# EAGLE design project8085 (EAGLE 7.3.0)
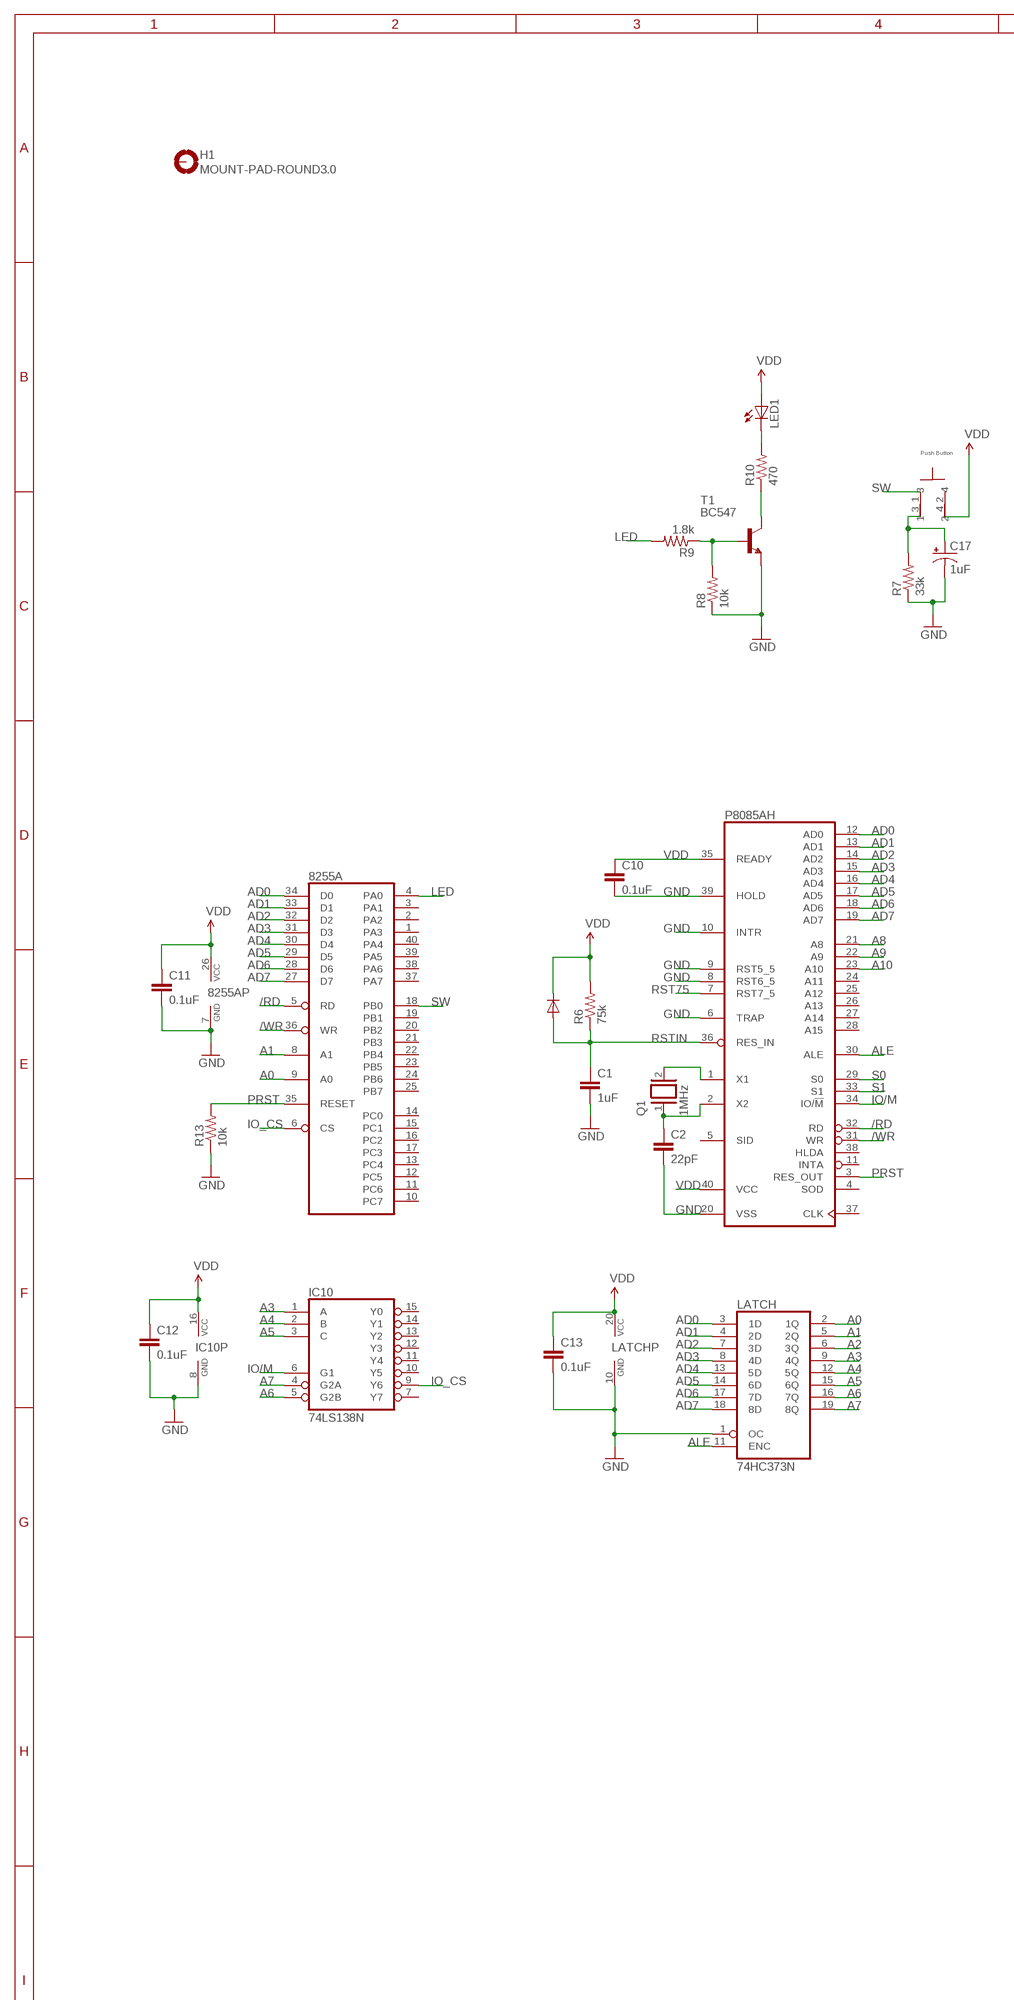
[diagram p0: schematic, sheet 1, part 1 of 2]
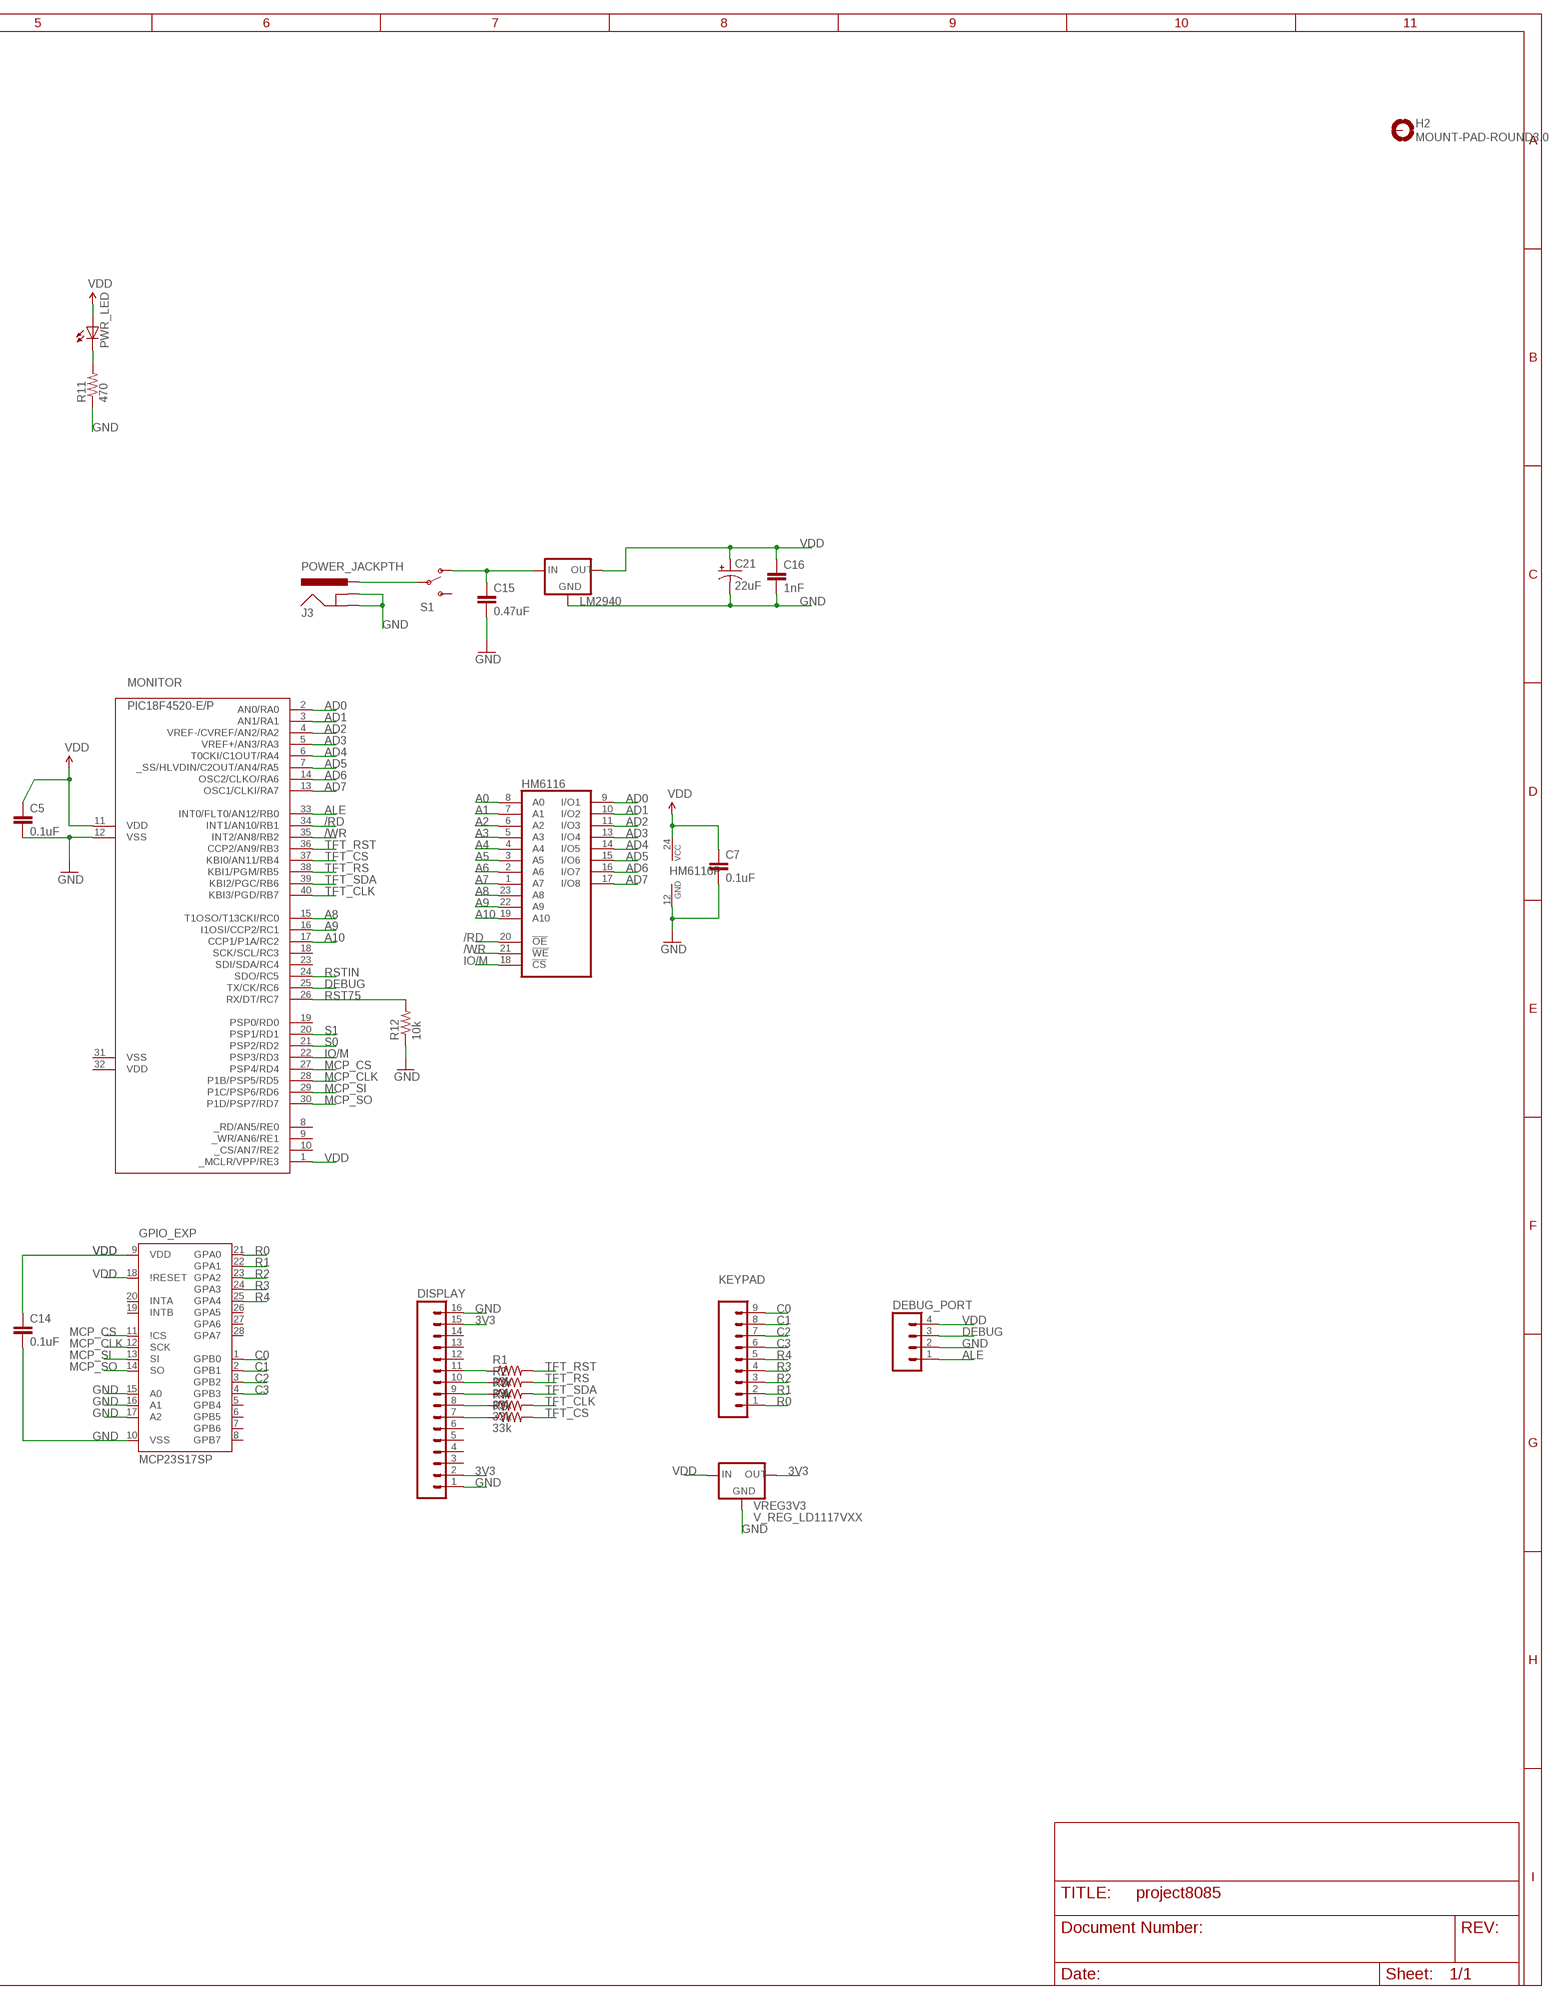
[diagram p1: schematic, sheet 1, part 2 of 2]

## Parts
8255A  8255A  [DIL40]
C1  1uF  CAPPTH  [CAP-PTH-SMALL]
C2  22pF  CAPPTH  [CAP-PTH-SMALL]
C5  0.1uF  CAPPTH  [CAP-PTH-SMALL]
C7  0.1uF  CAPPTH  [CAP-PTH-SMALL]
C10  0.1uF  CAPPTH  [CAP-PTH-SMALL]
C11  0.1uF  CAPPTH  [CAP-PTH-SMALL]
C12  0.1uF  CAPPTH  [CAP-PTH-SMALL]
C13  0.1uF  CAPPTH  [CAP-PTH-SMALL]
C14  0.1uF  CAPPTH  [CAP-PTH-SMALL]
C15  0.47uF  CAPPTH  [CAP-PTH-SMALL]
C16  1nF  CAPPTH  [CAP-PTH-SMALL]
C17  1uF  CAP_POLPTH2  [CPOL-RADIAL-10UF-25V]
C21  22uF  CAP_POLPTH2  [CPOL-RADIAL-10UF-25V]
DEBUG_PORT  M04PTH  [1X04]
DISPLAY  M16PTH  [1X16]
GPIO_EXP  MCP23S17SP  [DIL28-3]
H1  MOUNT-PAD-ROUND3.0  [3,0-PAD]
H2  MOUNT-PAD-ROUND3.0  [3,0-PAD]
HM6116  6116P  [DIL24-6]
IC10  74LS138N  [DIL16]
IN4148  1N4148DO35-10  [DO35-10]
J3  POWER_JACKPTH  [POWER_JACK_PTH]
KEYPAD  M09  [1X09]
LATCH  74HC373N  [DIL20]
LED1  LED5MM  [LED5MM]
LM2940  LM2931T-L  [TO220L1]
MONITOR  PIC18F4520-E/P  [DIL40]
P8085AH  8085  [DIL40]
PWR_LED  LED5MM  [LED5MM]
Q1  1MHz  XTAL  [Q]
R1  33k  RESISTORAXIAL-0.3  [AXIAL-0.3]
R2  33k  RESISTORAXIAL-0.3  [AXIAL-0.3]
R3  33k  RESISTORAXIAL-0.3  [AXIAL-0.3]
R4  33k  RESISTORAXIAL-0.3  [AXIAL-0.3]
R5  33k  RESISTORAXIAL-0.3  [AXIAL-0.3]
R6  75k  RESISTORAXIAL-0.3  [AXIAL-0.3]
R7  33k  RESISTORAXIAL-0.3  [AXIAL-0.3]
R8  10k  RESISTORAXIAL-0.3  [AXIAL-0.3]
R9  1.8k  RESISTORAXIAL-0.3  [AXIAL-0.3]
R10  470  RESISTORAXIAL-0.3  [AXIAL-0.3]
R11  470  RESISTORAXIAL-0.3  [AXIAL-0.3]
R12  10k  RESISTORAXIAL-0.3  [AXIAL-0.3]
R13  10k  RESISTORAXIAL-0.3  [AXIAL-0.3]
S1  SWITCH-SPDTPTH  [SWITCH-SPDT]
T1  BC547  [TO92]
U$3  PUSHBTN  [PUSHBTN]
VREG3V3  V_REG_LD1117VXX  [78XXL]

## Nets
3V3 [power]: DISPLAY.2 DISPLAY.15 VREG3V3.GND(OUT)
/RD: 8255A.5(RD) HM6116.20(!OE) MONITOR.34(INT1/AN10/RB1) P8085AH.32(RD)
/WR: 8255A.36(WR) HM6116.21(!WE) MONITOR.35(INT2/AN8/RB2) P8085AH.31(WR)
A0: 8255A.9(A0) HM6116.8(A0) LATCH.2(1Q)
A1: 8255A.8(A1) HM6116.7(A1) LATCH.5(2Q)
A2: HM6116.6(A2) LATCH.6(3Q)
A3: HM6116.5(A3) IC10.1(A) LATCH.9(4Q)
A4: HM6116.4(A4) IC10.2(B) LATCH.12(5Q)
A5: HM6116.3(A5) IC10.3(C) LATCH.15(6Q)
A6: HM6116.2(A6) IC10.5(G2B) LATCH.16(7Q)
A7: HM6116.1(A7) IC10.4(G2A) LATCH.19(8Q)
A8: HM6116.23(A8) MONITOR.15(T1OSO/T13CKI/RC0) P8085AH.21(A8)
A9: HM6116.22(A9) MONITOR.16(I1OSI/CCP2/RC1) P8085AH.22(A9)
A10: HM6116.19(A10) MONITOR.17(CCP1/P1A/RC2) P8085AH.23(A10)
AD0: 8255A.34(D0) HM6116.9(I/O1) LATCH.3(1D) MONITOR.2(AN0/RA0) P8085AH.12(AD0)
AD1: 8255A.33(D1) HM6116.10(I/O2) LATCH.4(2D) MONITOR.3(AN1/RA1) P8085AH.13(AD1)
AD2: 8255A.32(D2) HM6116.11(I/O3) LATCH.7(3D) MONITOR.4(VREF-/CVREF/AN2/RA2) P8085AH.14(AD2)
AD3: 8255A.31(D3) HM6116.13(I/O4) LATCH.8(4D) MONITOR.5(VREF+/AN3/RA3) P8085AH.15(AD3)
AD4: 8255A.30(D4) HM6116.14(I/O5) LATCH.13(5D) MONITOR.6(T0CKI/C1OUT/RA4) P8085AH.16(AD4)
AD5: 8255A.29(D5) HM6116.15(I/O6) LATCH.14(6D) MONITOR.7(_SS/HLVDIN/C2OUT/AN4/RA5) P8085AH.17(AD5)
AD6: 8255A.28(D6) HM6116.16(I/O7) LATCH.17(7D) MONITOR.14(OSC2/CLKO/RA6) P8085AH.18(AD6)
AD7: 8255A.27(D7) HM6116.17(I/O8) LATCH.18(8D) MONITOR.13(OSC1/CLKI/RA7) P8085AH.19(AD7)
ALE: DEBUG_PORT.1 LATCH.11(ENC) MONITOR.33(INT0/FLT0/AN12/RB0) P8085AH.30(ALE)
C0: GPIO_EXP.1(GPB0) KEYPAD.9
C1: GPIO_EXP.2(GPB1) KEYPAD.8
C2: GPIO_EXP.3(GPB2) KEYPAD.7
C3: GPIO_EXP.4(GPB3) KEYPAD.6
DEBUG: DEBUG_PORT.3 MONITOR.25(TX/CK/RC6)
GND [power]: 8255A.7(GND) C1.2 C2.2 C5.2 C7.2 C10.2 C11.2 C12.2 C13.2 C14.2 C15.2 C16.2 C17.2(-) C21.2(-) DEBUG_PORT.2 DISPLAY.1 DISPLAY.16 GPIO_EXP.10(VSS) GPIO_EXP.15(A0) GPIO_EXP.16(A1) GPIO_EXP.17(A2) HM6116.12(GND) IC10.8(GND) J3.GND J3.GNDBREAK LATCH.1(OC) LATCH.10(GND) LM2940.2(GND) MONITOR.12(VSS) P8085AH.6(TRAP) P8085AH.8(RST6_5) P8085AH.9(RST5_5) P8085AH.10(INTR) P8085AH.20(VSS) P8085AH.39(HOLD) R7.P$1 R8.P$1 R11.P$1 R12.P$1 R13.P$1 T1.1(E) VREG3V3.IN(GND)
IO/M: HM6116.18(!CS) IC10.6(G1) MONITOR.22(PSP3/RD3) P8085AH.34(IO/!M)
IO_CS: 8255A.6(CS) IC10.9(Y6)
LED: 8255A.4(PA0) R9.P$2
MCP_CLK: GPIO_EXP.12(SCK) MONITOR.28(P1B/PSP5/RD5)
MCP_CS: GPIO_EXP.11(\!CS) MONITOR.27(PSP4/RD4)
MCP_SI: GPIO_EXP.13(SI) MONITOR.29(P1C/PSP6/RD6)
MCP_SO: GPIO_EXP.14(SO) MONITOR.30(P1D/PSP7/RD7)
N$1: R8.P$2 R9.P$1 T1.2(B)
N$2: C15.1 LM2940.1(IN) S1.1(O)
N$3: C2.1 P8085AH.2(X2) Q1.1
N$4: P8085AH.1(X1) Q1.2
N$5 [power]: J3.PWR S1.2(P)
N$6: DISPLAY.11 R1.P$1
N$7: DISPLAY.10 R2.P$1
N$8: DISPLAY.9 R3.P$1
N$9: DISPLAY.8 R4.P$1
N$10: DISPLAY.7 R5.P$1
N$12: PWR_LED.K(C) R11.P$2
N$13: R10.P$1 T1.3(C)
N$14: LED1.K(C) R10.P$2
PRST: 8255A.35(RESET) P8085AH.3(RES_OUT) R13.P$2
R0: GPIO_EXP.21(GPA0) KEYPAD.1
R1: GPIO_EXP.22(GPA1) KEYPAD.2
R2: GPIO_EXP.23(GPA2) KEYPAD.3
R3: GPIO_EXP.24(GPA3) KEYPAD.4
R4: GPIO_EXP.25(GPA4) KEYPAD.5
RST75: MONITOR.26(RX/DT/RC7) P8085AH.7(RST7_5) R12.P$2
RSTIN: C1.1 IN4148.A MONITOR.24(SDO/RC5) P8085AH.36(RES_IN) R6.P$1
S0: MONITOR.21(PSP2/RD2) P8085AH.29(S0)
S1: MONITOR.20(PSP1/RD1) P8085AH.33(S1)
SW: 8255A.18(PB0) U$3.1
SW0: C17.1(+) R7.P$2 U$3.3
TFT_CLK: MONITOR.40(KBI3/PGD/RB7) R4.P$2
TFT_CS: MONITOR.37(KBI0/AN11/RB4) R5.P$2
TFT_RS: MONITOR.38(KBI1/PGM/RB5) R2.P$2
TFT_RST: MONITOR.36(CCP2/AN9/RB3) R1.P$2
TFT_SDA: MONITOR.39(KBI2/PGC/RB6) R3.P$2
VDD [power]: 8255A.26(VCC) C5.1 C7.1 C10.1 C11.1 C12.1 C13.1 C14.1 C16.1 C21.1(+) DEBUG_PORT.4 GPIO_EXP.9(VDD) GPIO_EXP.18(\!RESET) HM6116.24(VCC) IC10.16(VCC) IN4148.C LATCH.20(VCC) LED1.A LM2940.3(OUT) MONITOR.1(_MCLR/VPP/RE3) MONITOR.11(VDD) P8085AH.35(READY) P8085AH.40(VCC) PWR_LED.A R6.P$2 U$3.4 VREG3V3.OUT(IN)
Unconnected: 8255A.1(PA3) 8255A.2(PA2) 8255A.3(PA1) 8255A.10(PC7) 8255A.11(PC6) 8255A.12(PC5) 8255A.13(PC4) 8255A.14(PC0) 8255A.15(PC1) 8255A.16(PC2) 8255A.17(PC3) 8255A.19(PB1) 8255A.20(PB2) 8255A.21(PB3) 8255A.22(PB4) 8255A.23(PB5) 8255A.24(PB6) 8255A.25(PB7) 8255A.37(PA7) 8255A.38(PA6) 8255A.39(PA5) 8255A.40(PA4) DISPLAY.3 DISPLAY.4 DISPLAY.5 DISPLAY.6 DISPLAY.12 DISPLAY.13 DISPLAY.14 GPIO_EXP.5(GPB4) GPIO_EXP.6(GPB5) GPIO_EXP.7(GPB6) GPIO_EXP.8(GPB7) GPIO_EXP.19(INTB) GPIO_EXP.20(INTA) GPIO_EXP.26(GPA5) GPIO_EXP.27(GPA6) GPIO_EXP.28(GPA7) H1.B3,0(MOUNT) H2.B3,0(MOUNT) IC10.7(Y7) IC10.10(Y5) IC10.11(Y4) IC10.12(Y3) IC10.13(Y2) IC10.14(Y1) IC10.15(Y0) MONITOR.8(_RD/AN5/RE0) MONITOR.9(_WR/AN6/RE1) MONITOR.10(_CS/AN7/RE2) MONITOR.18(SCK/SCL/RC3) MONITOR.19(PSP0/RD0) MONITOR.23(SDI/SDA/RC4) P8085AH.4(SOD) P8085AH.5(SID) P8085AH.11(INTA) P8085AH.24(A11) P8085AH.25(A12) P8085AH.26(A13) P8085AH.27(A14) P8085AH.28(A15) P8085AH.37(CLK) P8085AH.38(HLDA) S1.3(S) U$3.2

## Power pins joined to a net without a drawn wire
VDD: MONITOR.32(VDD)
VSS: MONITOR.31(VSS)

## Library data of the parts
8255A = micro-intel:8255A: MICROCOMPUTER/PERIPHERAL DEVICE; OC_FARNELL: unknown; OC_NEWARK: unknown
C1 C2 C5 C7 C10-C16 = SparkFun:CAP: Capacitor Standard 0603 ceramic capacitor, and 0.1" leaded capacitor.
C17 C21 = SparkFun:CAP_POL: Capacitor Polarized These are standard SMD and PTH capacitors. Normally 10uF, 47uF, and 100uF in electrolytic and tantalum varieties. Always verify the external diameter of the through hole cap, it varies with capacity, voltage, and manufacturer. The EIA devices should be standard.
DEBUG_PORT = SparkFun-Connectors:M04: Header 4 Standard 4-pin 0.1" header. Use with straight break away headers (SKU : PRT-00116), right angle break away headers (PRT-00553), swiss pins (PRT-00743), machine pins (PRT-00117), and female headers (PRT-00115). Molex polarized connector foot print use with SKU : PRT-08231 with associated crimp pins and housings. 1MM SMD Version SKU: PRT-10208; PROD_ID: CONN-09696
DISPLAY = SparkFun-Connectors:M16: 1x16 .1" header
GPIO_EXP = microchip-update-2:MCP23S17: http://ww1.microchip.com/downloads/en/DeviceDoc/21952a.pdf Source: http://ww1.microchip.com/downloads/en/DeviceDoc/21952a.pdf
H1 H2 = holes:MOUNT-PAD-ROUND: MOUNTING PAD, round
HM6116 = memory-idt:6116P: MEMORY; OC_FARNELL: unknown; OC_NEWARK: unknown
IC10 = 74xx-eu:74*138: 3-line to 8-line DECODER/DEMULTIPLEXER
IN4148 = diode:1N4148: DIODE high speed (Philips)
J3 = SparkFun:POWER_JACK: Power Jack This is the standard 5.5mm barrel jack for power. The PTH is the most common, proven, reliable, footprint. All others are experimental. The Slot footprint only works if the mill layer is transmitted to the PCB fab house so be warned. Spark Fun Electronics SKU : PRT-00119. Mating wall wart : TOL-00298 (and others)
KEYPAD = SparkFun-Connectors:M09: Header 9 Standard 9-pin 0.1" header. Use with straight break away headers (SKU : PRT-00116), right angle break away headers (PRT-00553), swiss pins (PRT-00743), machine pins (PRT-00117), and female headers (PRT-00115).
LATCH = 74xx-eu:74*373: Octal D type transparent LATCH, edge triggered
LED1 PWR_LED = led:LED: LED OSRAM: - CHIPLED LG R971, LG N971, LY N971, LG Q971, LY Q971, LO R971, LY R971 LH N974, LH R974 LS Q976, LO Q976, LY Q976 LO Q996 - Hyper CHIPLED LW Q18S LB Q993, LB Q99A, LB R99A - SideLED LS A670, LO A670, LY A670, LG A670, LP A670 LB A673, LV A673, LT A673, LW A673 LH A674 LY A675 LS A676, LA A676, LO A676, LY A676, LW A676 LS A679, LY A679, LG A679 - Hyper Micro SIDELED® LS Y876, LA Y876, LO Y876, LY Y876 LT Y87S - SmartLED LW L88C, LW L88S LB L89C, LB L89S, LG L890 LS L89K, LO L89K, LY L89K LS L896, LA L896, LO L896, LY L896 - TOPLED LS T670, LO T670, LY T670, LG T670, LP T670 LSG T670, LSP T670, LSY T670, LOP T670, LYG T670 LG T671, LOG T671, LSG T671 LB T673, LV T673, LT T673, LW T673 LH T674 LS T676, LA T676, LO T676, LY T676, LB T676, LH T676, LSB T676, LW T676 LB T67C, LV T67C, LT T67C, LS T67K, LO T67K, LY T67K, LW E67C LS E67B, LA E67B, LO E67B, LY E67B, LB E67C, LV E67C, LT E67C LW T67C LS T679, LY T679, LG T679 LS T770, LO T770, LY T770, LG T770, LP T770 LB T773, LV T773, LT T773, LW T773 LH T774 LS E675, LA E675, LY E675, LS T675 LS T776, LA T776, LO T776, LY T776, LB T776 LHGB T686 LT T68C, LB T68C - Hyper Mini TOPLED® LB M676 - Mini TOPLED Santana® LG M470 LS M47K, LO M47K, LY M47K Source: http://www.osram.convergy.de LUXEON: - LUMILED® LXK2-PW12-R00, LXK2-PW12-S00, LXK2-PW14-U00, LXK2-PW14-V00 LXK2-PM12-R00, LXK2-PM12-S00, LXK2-PM14-U00 LXK2-PE12-Q00, LXK2-PE12-R00, LXK2-PE12-S00, LXK2-PE14-T00, LXK2-PE14-U00 LXK2-PB12-K00, LXK2-PB12-L00, LXK2-PB12-M00, LXK2-PB14-N00, LXK2-PB14-P00, LXK2-PB14-Q00 LXK2-PR12-L00, LXK2-PR12-M00, LXK2-PR14-Q00, LXK2-PR14-R00 LXK2-PD12-Q00, LXK2-PD12-R00, LXK2-PD12-S00 LXK2-PH12-R00, LXK2-PH12-S00 LXK2-PL12-P00, LXK2-PL12-Q00, LXK2-PL12-R00 Source: www.luxeon.com KINGBRIGHT: KA-3528ASYC Source: www.kingbright.com
LM2940 = v-reg-3:LM2931: National Semiconductor <http://www.national.com> Low Dropout Fixed Regulator Vin up to 26V, Reverse Batterie/Load Dump/Short Circuit/Overload Protection,
MONITOR = pic18fxx20:PIC18*4520: PIC18*4520 Microchip FLASH Microcontroller with A/D DEVICE FEATURES Feature PIC18*4520 Program Memory (bytes) 32768 Program Memory (instructions) 16384 Interupt Sources 20 I/O Ports Ports A, B, C, D, E Capture/Compare/PWM Modules 1 Enhanced Capture/Compare/PWM Modules 1 Parallel Communications (PSP) Yes 10-bit Analog-to-Digital Module 13 input Channels Package Types 40-pin PDIP 44-pin TQFP 44-pin QFN NOTES: F only after 18, means standard voltage range from 4.2v to 5.5v LF after 18, means extended voltage range from 2.0v to 5.5v -E before / denotes extended temperature range from -40°C to +120°C -I before / denotes industrial temperature range from -40°C to +85°C /PT suffix denotes TQFP package /SO suffix denotes SOIC package /SP suffix denotes Skinny Plastic DIP package /P suffix denotes Plastic DIP package /ML suffix denotes QFN package
P8085AH = micro-intel:8085: MICROCOMPUTER/PERIPHERAL DEVICE; OC_FARNELL: unknown; OC_NEWARK: unknown
Q1 = special:XTAL: CRYSTAL
R1-R13 = SparkFun-Resistors:RESISTOR: Resistor Basic schematic elements and footprints for 0603, 1206, and PTH resistors.
S1 = SparkFun-Electromechanical:SWITCH-SPDT: SPDT Switch Simple slide switch, Spark Fun Electronics SKU : COM-00102 DPDT SMT slide switch, AYZ0202, SWCH-08179; PROD_ID: SWCH-08261
T1 = transistor:BC547: NPN TRANSISTOR
U$3 = bens:PUSHBTN: 4-Pin Push Button Switch Pins 1+3 are interconnected Pins 2+4 are interconnected
VREG3V3 = SparkFun:V_REG_LD1117VXX: LD1117VXX voltage regulator. We carry the 3.3V version (COM-00526) in TO-220 package.

## Net classes
0 default: width 0.254 mm, clearance 0.305 mm
1 power: width 0.61 mm, clearance 0.254 mm

## Board
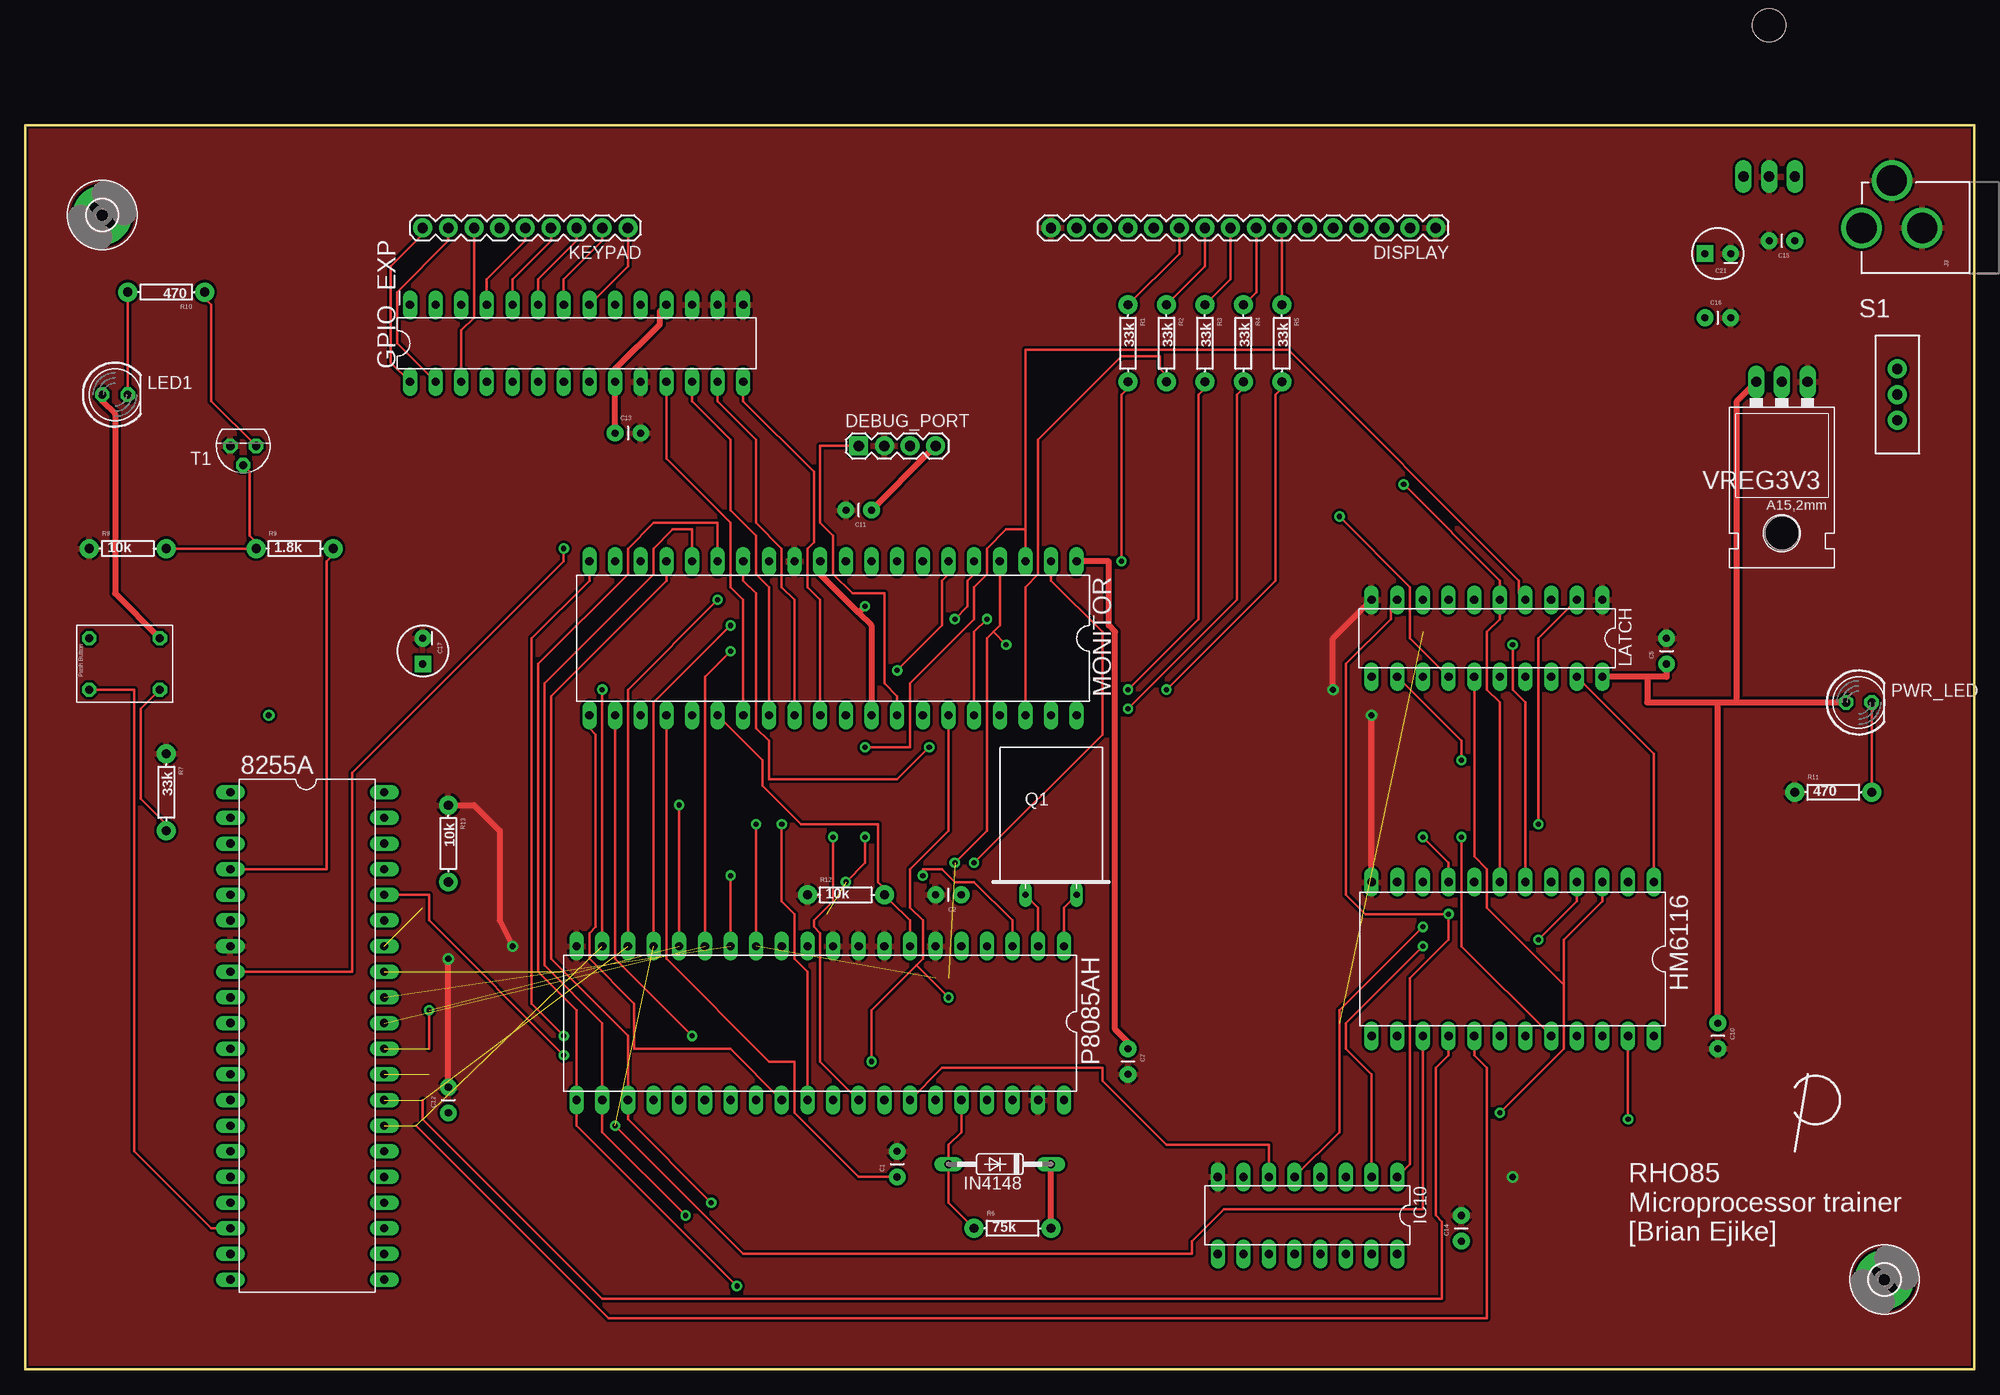
[diagram p2: board, top side]
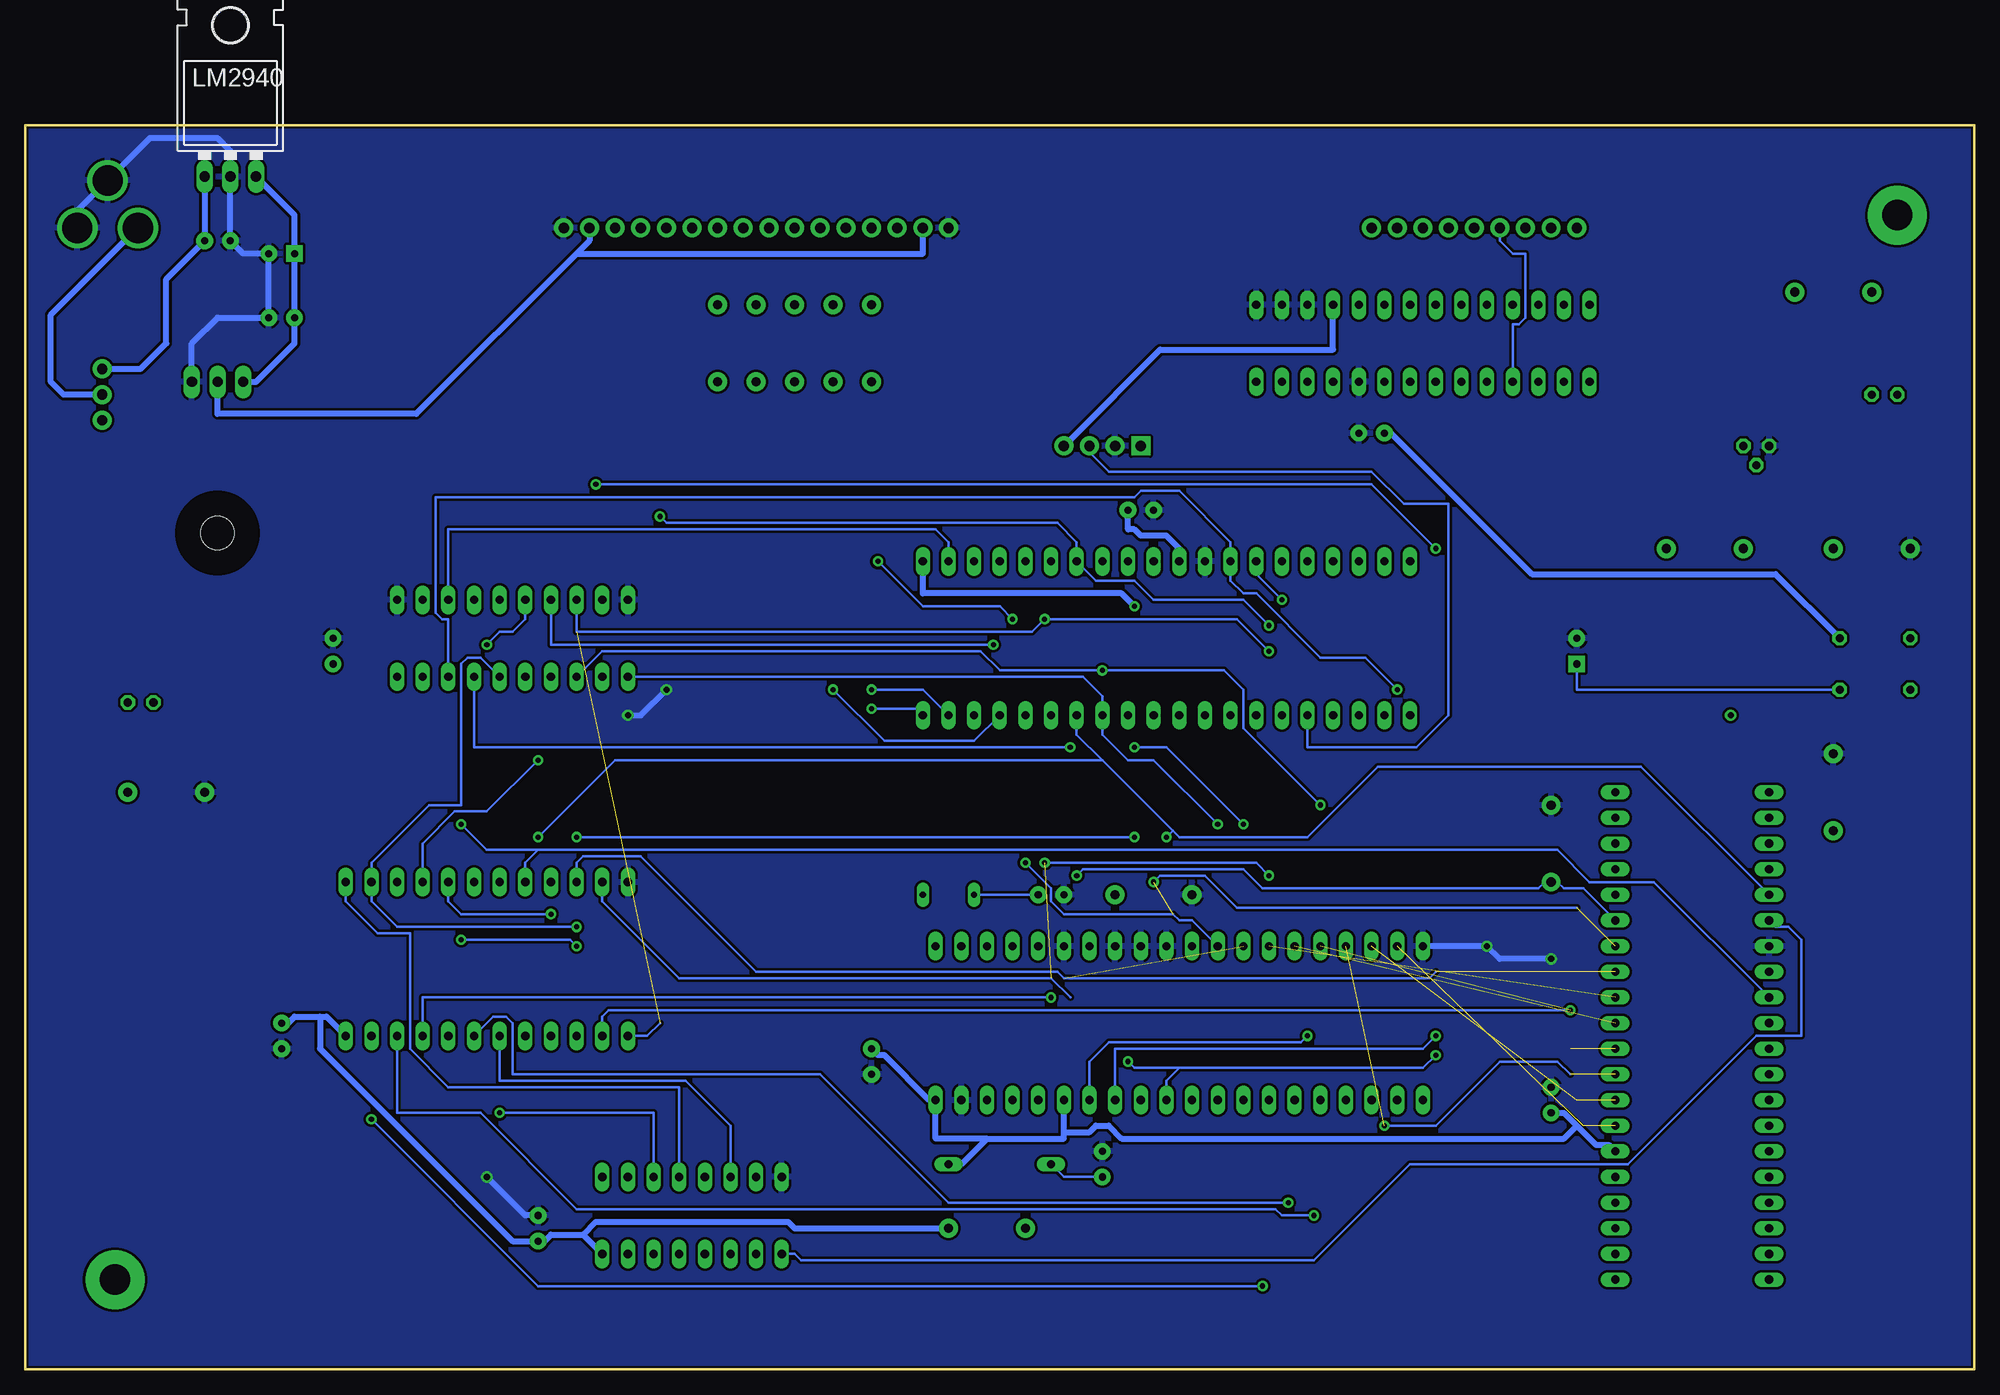
[diagram p3: board, bottom side, seen from below]

Size 193.04 x 123.19 mm. Coordinates in mm from the lower left corner, seen from the top.
Outline: 0,0 0,123.19 193.04,123.19 193.04,0 0,0
Copper layers (1*16): Top 0.035mm / dielectric 1.5mm / Bottom 0.035mm
Design rules "SparkFun": minimum track width 8mil, minimum drill 20mil, track to track 8mil, track to pad 8mil, pad to pad 8mil, via to via 8mil, smd to smd 8mil, copper to edge 8mil, drill to drill 8mil, minimum pad ring 12mil, minimum via ring 10mil, stop-mask expansion 4mil, vias tented up to drill 20mil, thermal gap 10mil

### Footprints (pad centres in the part's own frame; a part is rotated, then mirrored left to right if it is on the bottom)
DIL40 = drill 0.813 long: 1 -24.13,-7.62; 2 -21.59,-7.62; 3 -19.05,-7.62; 4 -16.51,-7.62; 5 -13.97,-7.62; 6 -11.43,-7.62; 7 -8.89,-7.62; 8 -6.35,-7.62; 9 -3.81,-7.62; 10 -1.27,-7.62; 11 1.27,-7.62; 12 3.81,-7.62; 13 6.35,-7.62; 14 8.89,-7.62; 15 11.43,-7.62; 16 13.97,-7.62; 17 16.51,-7.62; 18 19.05,-7.62; 19 21.59,-7.62; 20 24.13,-7.62; 21 24.13,7.62; 22 21.59,7.62; 23 19.05,7.62; 24 16.51,7.62; 25 13.97,7.62; 26 11.43,7.62; 27 8.89,7.62; 28 6.35,7.62; 29 3.81,7.62; 30 1.27,7.62; 31 -1.27,7.62; 32 -3.81,7.62; 33 -6.35,7.62; 34 -8.89,7.62; 35 -11.43,7.62; 36 -13.97,7.62; 37 -16.51,7.62; 38 -19.05,7.62; 39 -21.59,7.62; 40 -24.13,7.62
CAP-PTH-SMALL = drill 0.7 pad 1.651: 1 0,0; 2 2.54,0
CPOL-RADIAL-10UF-25V = drill 0.7 pad 1.651 square: 1 1.27,0 | drill 0.7 pad 1.651: 2 -1.27,0
1X04 = drill 1.016 pad 1.88 square: 1 0,0 | drill 1.016 pad 1.88: 2 2.54,0; 3 5.08,0; 4 7.62,0
1X16 = drill 1.016 pad 1.88: 1 0,0; 2 2.54,0; 3 5.08,0; 4 7.62,0; 5 10.16,0; 6 12.7,0; 7 15.24,0; 8 17.78,0; 9 20.32,0; 10 22.86,0; 11 25.4,0; 12 27.94,0; 13 30.48,0; 14 33.02,0; 15 35.56,0; 16 38.1,0
DIL28-3 = drill 0.813 long: 1 -16.51,-3.81; 2 -13.97,-3.81; 3 -11.43,-3.81; 4 -8.89,-3.81; 5 -6.35,-3.81; 6 -3.81,-3.81; 7 -1.27,-3.81; 8 1.27,-3.81; 9 3.81,-3.81; 10 6.35,-3.81; 11 8.89,-3.81; 12 11.43,-3.81; 13 13.97,-3.81; 14 16.51,-3.81; 15 16.51,3.81; 16 13.97,3.81; 17 11.43,3.81; 18 8.89,3.81; 19 6.35,3.81; 20 3.81,3.81; 21 1.27,3.81; 22 -1.27,3.81; 23 -3.81,3.81; 24 -6.35,3.81; 25 -8.89,3.81; 26 -11.43,3.81; 27 -13.97,3.81; 28 -16.51,3.81
3,0-PAD = drill 3 pad 5.842: B3,0 0,0
DIL24-6 = drill 0.813 long: 1 -13.97,-7.62; 2 -11.43,-7.62; 3 -8.89,-7.62; 4 -6.35,-7.62; 5 -3.81,-7.62; 6 -1.27,-7.62; 7 1.27,-7.62; 8 3.81,-7.62; 9 6.35,-7.62; 10 8.89,-7.62; 11 11.43,-7.62; 12 13.97,-7.62; 13 13.97,7.62; 14 11.43,7.62; 15 8.89,7.62; 16 6.35,7.62; 17 3.81,7.62; 18 1.27,7.62; 19 -1.27,7.62; 20 -3.81,7.62; 21 -6.35,7.62; 22 -8.89,7.62; 23 -11.43,7.62; 24 -13.97,7.62
DIL16 = drill 0.813 long: 1 -8.89,-3.81; 2 -6.35,-3.81; 3 -3.81,-3.81; 4 -1.27,-3.81; 5 1.27,-3.81; 6 3.81,-3.81; 7 6.35,-3.81; 8 8.89,-3.81; 9 8.89,3.81; 10 6.35,3.81; 11 3.81,3.81; 12 1.27,3.81; 13 -1.27,3.81; 14 -3.81,3.81; 15 -6.35,3.81; 16 -8.89,3.81
DO35-10 = drill 0.813 long: A 5.08,0; C -5.08,0
POWER_JACK_PTH = drill 2.997: GND 0,7.7; GNDBREAK 4.7,10.7; PWR 0,13.7
1X09 = drill 1.016 pad 1.88: 1 0,0; 2 2.54,0; 3 5.08,0; 4 7.62,0; 5 10.16,0; 6 12.7,0; 7 15.24,0; 8 17.78,0; 9 20.32,0
DIL20 = drill 0.813 long: 1 -11.43,-3.81; 2 -8.89,-3.81; 3 -6.35,-3.81; 4 -3.81,-3.81; 5 -1.27,-3.81; 6 1.27,-3.81; 7 3.81,-3.81; 8 6.35,-3.81; 9 8.89,-3.81; 10 11.43,-3.81; 11 11.43,3.81; 12 8.89,3.81; 13 6.35,3.81; 14 3.81,3.81; 15 1.27,3.81; 16 -1.27,3.81; 17 -3.81,3.81; 18 -6.35,3.81; 19 -8.89,3.81; 20 -11.43,3.81
LED5MM = drill 0.813 octagon: A -1.27,0; K 1.27,0
TO220L1 = drill 1.016 long: 1 -2.54,-3.81; 2 0,-3.81; 3 2.54,-3.81 | hole 3.302: 0,11.176
Q = drill 0.61 long: 1 -2.54,-7.62; 2 2.54,-7.62
AXIAL-0.3 = drill 0.9 pad 1.88: P$1 -3.81,0; P$2 3.81,0
SWITCH-SPDT = drill 1.016 pad 1.88: 1 0,2.54; 2 0,0; 3 0,-2.54
TO92 = drill 0.813 octagon: 1 1.27,0; 2 0,1.905; 3 -1.27,0
PUSHBTN = drill 0.8 octagon: 1 -2.54,3.81; 2 2.54,3.81; 3 -2.54,-3.175; 4 2.54,-3.175
78XXL = drill 1.016 long: GND 0,-3.81; IN -2.54,-3.81; OUT 2.54,-3.81 | hole 3.302: 0,11.176

### Placement (x,y rotation side)
8255A  27.94,33.02 270 top
C1  86.36,19.05 90 top
C2  92.71,46.99 180 top
C5  162.56,69.85 90 top
C7  109.22,31.75 270 top
C10  167.64,34.29 270 top
C11  83.82,85.09 180 top
C12  41.91,25.4 90 top
C13  58.42,92.71 0 top
C14  142.24,12.7 90 top
C15  175.26,111.76 180 top
C16  166.37,104.14 0 top
C17  39.37,71.12 270 top
C21  167.64,110.49 180 top
DEBUG_PORT  82.55,91.44 0 top
DISPLAY  139.7,113.03 180 top
GPIO_EXP  54.61,101.6 0 top
H1  7.62,114.3 0 top
H2  184.15,8.89 0 top
HM6116  147.32,40.64 180 top
IC10  127,15.24 180 top
IN4148  96.52,20.32 180 top
J3  195.58,113.03 90 top
KEYPAD  59.69,113.03 180 top
LATCH  144.78,72.39 180 top
LED1  8.89,96.52 0 top
LM2940  172.72,121.92 0 bottom
MONITOR  80.01,72.39 180 top
P8085AH  78.74,34.29 180 top
PWR_LED  181.61,66.04 0 top
Q1  101.6,54.61 0 top
R1  109.22,101.6 270 top
R2  113.03,101.6 270 top
R3  116.84,101.6 270 top
R4  120.65,101.6 270 top
R5  124.46,101.6 270 top
R6  97.79,13.97 0 top
R7  13.97,57.15 270 top
R8  10.16,81.28 0 top
R9  26.67,81.28 0 top
R10  13.97,106.68 180 top
R11  179.07,57.15 0 top
R12  81.28,46.99 0 top
R13  41.91,52.07 270 top
S1  185.42,96.52 0 top
T1  21.59,91.44 180 top
U$3  10.16,69.85 90 top
VREG3V3  173.99,93.98 180 top

### Tracks (layer width: path | path; a pad name or v marks a point on that pad's centre or on a via)
3V3
  Bottom 0.61: VREG3V3.GND 173.99,94.61 154.31,94.61 138.43,110.49 | 138.43,110.49 137.16,111.76 DISPLAY.2 | DISPLAY.15 104.14,110.49 138.43,110.49
/RD  (via drill 0.51)
  Top 0.254: P8085AH.32 78.74,30.48 78.74,43.18 78.11,43.81 78.11,44.45 80.01,46.35 v80.01,52.7 | HM6116.20 142.24,41.91 v142.24,52.7
  Bottom 0.254: 8255A.5 33.02,59.69 59.05,59.69 66.04,52.7 78.74,52.7 79.38,53.34 | 86.36,60.33 88.9,62.87 MONITOR.34 | 86.36,60.33 79.38,53.34 | 79.38,53.34 v80.01,52.7 | v142.24,52.7 134.62,60.33 86.36,60.33
/WR  (via drill 0.51)
  Top 0.254: 8255A.36 40.01,46.99 40.01,44.45 v53.34,31.11 | MONITOR.35 91.44,53.34 87.63,49.53 87.63,45.72 88.9,44.45 88.9,40.64 88.27,40.01 | 88.27,40.01 83.82,35.56 v83.82,30.48 | 88.27,40.01 v91.44,36.83
  Bottom 0.254: v53.34,31.11 54.61,29.84 78.74,29.84 | 78.74,29.84 80.01,28.57 P8085AH.31 | v83.82,30.48 83.19,29.84 78.74,29.84 | HM6116.21 153.67,36.83 v91.44,36.83
A0  (via drill 0.51)
  Top 0.254: LATCH.2 149.86,72.39 v149.86,53.98
  Bottom 0.254: 8255A.9 31.75,48.26 38.1,48.26 41.27,51.44 142.24,51.44 | 142.24,51.44 143.51,50.16 HM6116.8 | v149.86,53.98 147.32,51.44 142.24,51.44
A1  (via drill 0.51)
  Top 0.254: 8255A.8 32.38,39.37 32.38,59.05 53.34,80.01 v53.34,81.28 | v136.53,87.63 146.05,78.11 LATCH.5 146.05,74.3 144.78,73.03 144.78,67.31 146.05,66.04 HM6116.7
  Bottom 0.254: v53.34,81.28 59.69,87.63 v136.53,87.63
A2  (via drill 0.51)
  Top 0.254: HM6116.6 148.59,66.04 147.32,67.31 v147.32,71.75
  Bottom 0.254: v147.32,71.75 146.05,73.03 144.78,73.03 143.51,74.3 LATCH.6
A3  (via drill 0.51)
  Top 0.254: IC10.1 137.16,20.32 137.16,38.73 140.97,42.55 v140.97,45.09 132.72,45.09 130.81,46.99 130.81,69.85 135.25,74.3 135.25,75.56 LATCH.9
  Bottom 0.254: v140.97,45.09 149.86,45.09 151.13,46.35 HM6116.5
A4  (via drill 0.51)
  Top 0.254: IC10.2 133.35,29.21 130.81,31.75 130.81,34.29 v138.43,41.91 | v149.86,42.55 153.67,46.35 HM6116.4 | LATCH.12 142.24,62.23 v142.24,60.33
  Bottom 0.254: v138.43,41.91 139.06,42.55 v149.86,42.55 | v142.24,60.33 147.32,55.24 150.5,55.24 153.67,52.07 HM6116.4
A5  (via drill 0.51)
  Top 0.254: v146.05,25.4 152.4,31.75 152.4,38.1 | 152.4,38.1 152.4,42.55 156.21,46.35 HM6116.3 | LATCH.15 143.51,50.8 144.78,49.53 144.78,45.72 152.4,38.1
  Bottom 0.254: IC10.3 130.81,25.4 v146.05,25.4
A6  (via drill 0.51)
  Top 0.254: IC10.5 130.18,23.5 130.18,35.56 v138.43,43.81
  Bottom 0.254: v138.43,43.81 156.21,43.81 158.75,46.35 HM6116.2 158.75,50.16 153.03,55.88 149.86,55.88 149.86,69.85 149.22,70.48 147.96,70.48 LATCH.16
A7
  Top 0.254: LATCH.19 161.29,60.96 HM6116.1
  Bottom 0.254: IC10.4 128.27,27.94 151.13,27.94 154.94,31.75 154.94,43.18 158.12,43.18 161.29,46.35 HM6116.1
A8  (via drill 0.51)
  Top 0.254: MONITOR.15 68.58,83.82 62.23,83.82 59.69,81.28 59.69,78.74 50.8,69.85 50.8,39.37 54.61,35.56 P8085AH.21 54.61,24.13 v70.48,8.26 | v158.75,24.77 HM6116.23
  Bottom 0.254: v158.75,24.77 142.24,8.26 v70.48,8.26
A9  (via drill 0.51)
  Top 0.254: MONITOR.16 66.04,83.19 64.14,83.19 62.23,81.28 62.23,78.74 51.44,67.94 51.44,40.01 57.15,34.29 P8085AH.22 57.15,23.5 v65.41,15.24
  Bottom 0.254: HM6116.22 156.21,25.4 147.96,25.4 138.43,15.88 69.22,15.88 68.58,15.24 v65.41,15.24
A10  (via drill 0.51)
  Top 0.254: MONITOR.17 63.5,78.11 52.07,66.67 52.07,40.64 59.69,33.02 P8085AH.23 59.69,24.77 v67.94,16.51
  Bottom 0.254: HM6116.19 146.69,34.92 145.41,34.92 144.78,34.29 144.78,29.21 114.3,29.21 101.6,16.51 v67.94,16.51
AD0  (via drill 0.51)  (2 unrouted)
  Top 0.254: v93.98,50.16 106.68,62.87 106.68,73.03 101.6,78.11 MONITOR.2 | v81.28,48.26 83.19,50.16 v83.19,52.7 | v138.43,52.7 140.97,50.16 HM6116.9
  Bottom 0.254: P8085AH.12 77.47,44.45 78.74,44.45 79.38,45.09 90.17,45.09 91.44,46.35 91.44,47.62 v93.98,50.16 | LATCH.3 151.13,83.19 102.87,83.19 101.6,81.92 MONITOR.2 | 39.37,45.72 73.03,45.72 76.2,48.9 80.64,48.9 v81.28,48.26 | v138.43,52.7 v83.19,52.7
AD1  (via drill 0.51)  (2 unrouted)
  Top 0.254: v72.39,53.98 P8085AH.13 | v83.19,61.59 87.63,61.59 87.63,67.94 93.98,74.3 93.98,77.47 95.25,78.74 95.25,81.28 97.16,83.19 99.06,83.19 | MONITOR.3 99.06,83.19 | LATCH.4 147.96,76.83 147.96,78.11 125.09,100.97 99.06,100.97 99.06,83.19
  Bottom 0.254: v72.39,53.98 80.01,61.59 v83.19,61.59 | 53.34,39.37 53.98,38.73 90.17,38.73 90.81,39.37 120.65,39.37 132.08,50.8 137.79,50.8 138.43,50.16 HM6116.10
AD2  (via drill 0.51)  (2 unrouted)
  Top 0.254: v69.85,48.9 P8085AH.14 | v92.08,50.16 95.25,53.34 95.25,72.39 95.89,73.03 | 95.89,73.03 96.52,73.66 MONITOR.4 | 95.89,73.03 v97.16,71.75
  Bottom 0.254: v69.85,48.9 71.12,50.16 v92.08,50.16 | LATCH.7 140.97,71.75 v97.16,71.75 | 89.53,36.83 91.44,38.73 128.27,38.73 135.89,46.35 HM6116.11
AD3  (via drill 0.51)  (2 unrouted)
  Top 0.254: P8085AH.15 67.31,68.58 v69.85,71.12 | v92.08,74.3 93.34,75.56 93.34,78.11 93.98,78.74 MONITOR.5
  Bottom 0.254: v69.85,71.12 73.03,74.3 v92.08,74.3 93.34,73.03 138.43,73.03 LATCH.8 | 130.18,34.29 131.44,33.02 HM6116.13
AD4  (via drill 0.51)  (2 unrouted)
  Top 0.254: v64.77,55.88 P8085AH.16 | v86.36,69.22 90.81,73.66 90.81,78.11 91.44,78.74 MONITOR.6 | v40.01,35.56 40.01,31.75
  Bottom 0.254: v64.77,55.88 72.39,63.5 72.39,67.31 74.3,69.22 v86.36,69.22 96.52,69.22 98.42,71.12 135.89,71.12 LATCH.13 | v40.01,35.56 135.25,35.56 135.89,34.92 HM6116.14
AD5  (via drill 0.51)  (2 unrouted)
  Top 0.254: P8085AH.17 62.23,66.04 v69.85,73.66 | LATCH.14 137.16,72.39 137.16,77.47 v130.18,84.45 | v58.42,24.13 71.12,11.43 115.57,11.43 115.57,12.7 118.75,15.88 138.43,15.88 HM6116.15
  Bottom 0.254: v69.85,73.66 72.39,76.2 81.28,76.2 83.19,78.11 87,78.11 MONITOR.7 88.9,81.92 90.81,83.82 129.54,83.82 v130.18,84.45 | 40.01,29.21 41.27,30.48 46.99,30.48 53.34,24.13 v58.42,24.13
AD6  (via drill 0.51)  (2 unrouted)
  Top 0.254: P8085AH.18 59.69,67.31 v68.58,76.2 | v89.53,61.59 86.36,58.42 73.66,58.42 73.66,62.23 72.39,63.5 72.39,76.83 71.12,78.11 MONITOR.14 | 39.37,26.67 39.37,24.77 57.15,6.99 140.34,6.99 140.34,14.61 139.7,15.24 139.7,29.84 140.97,31.11 HM6116.16
  Bottom 0.254: v68.58,76.2 71.12,78.74 MONITOR.14 | LATCH.17 148.59,61.59 v89.53,61.59
AD7  (via drill 0.51)  (2 unrouted)
  Top 0.254: v57.15,67.31 P8085AH.19 | 38.73,24.13 57.78,5.08 144.78,5.08 144.78,29.84 143.51,31.11 HM6116.17
  Bottom 0.254: v57.15,67.31 60.33,70.48 64.77,70.48 71.12,76.83 72.39,76.83 73.66,78.11 MONITOR.13 73.66,81.92 78.74,87 82.55,87 83.19,86.36 152.4,86.36 152.4,74.93 151.76,74.3 151.13,74.3 LATCH.18
ALE  (via drill 0.51)
  Top 0.254: P8085AH.30 77.47,39.37 76.2,40.64 76.2,45.09 74.93,46.35 v74.93,53.98 | DEBUG_PORT.1 78.74,91.44 78.74,83.82 80.01,82.55 80.01,78.74 81.92,76.83 85.09,76.83 85.09,67.94 86.36,66.67 MONITOR.33
  Bottom 0.254: v74.93,53.98 81.28,60.33 83.82,60.33 86.36,62.87 MONITOR.33 86.36,66.67 88.27,68.58 LATCH.11
C0
  Top 0.254: GPIO_EXP.1 36.2,99.69 36.2,109.22 39.37,112.39 KEYPAD.9
C1
  Top 0.254: GPIO_EXP.2 36.83,101.6 36.83,106.68 41.91,111.76 KEYPAD.8
C2
  Top 0.254: GPIO_EXP.3 43.18,102.87 44.45,104.14 KEYPAD.7
C3
  Bottom 0.254: GPIO_EXP.4 45.72,103.5 45.09,103.5 44.45,104.14 44.45,110.49 45.72,110.49 46.99,111.76 KEYPAD.6
DEBUG
  Bottom 0.254: MONITOR.25 66.04,61.59 55.24,61.59 52.07,64.77 52.07,85.72 56.52,85.72 59.69,88.9 85.72,88.9 87.63,90.81 DEBUG_PORT.3
GND  (via drill 0.6)
  Top 0.61: R13.P$1 44.45,55.88 46.99,53.34 46.99,44.45 v48.26,41.91 | C12.2 v41.91,40.64 | HM6116.12 v133.35,64.77 | v129.54,67.31 129.54,72.39 LATCH.10
  Bottom 0.61: J3.GND 187.88,114.73 J3.GNDBREAK 180.69,121.92 173.99,121.92 172.72,120.65 LM2940.2 C15.2 171.45,110.49 C21.2 C16.2 173.99,104.14 176.53,101.6 VREG3V3.IN | P8085AH.20 v48.26,41.91 46.99,40.64 v41.91,40.64 | C14.2 143.51,15.24 v147.32,19.05 | v133.35,64.77 132.08,64.77 v129.54,67.31
  pour Bottom: 0,0 0,123.19 193.04,123.19 193.04,0
  pour Top: 0,0 0,123.19 193.04,123.19 193.04,0
IO/M  (via drill 0.51)
  Top 0.254: P8085AH.34 90.81,29.84 106.68,29.84 106.68,28.57 113.03,22.23 123.19,22.23 IC10.6 | MONITOR.22 58.42,40.64 v66.04,33.02
  Bottom 0.254: v66.04,33.02 66.67,32.38 85.72,32.38 87.63,30.48 P8085AH.34 | HM6116.18 146.05,28.57 127.64,28.57 123.19,24.13 IC10.6
IO_CS
  Bottom 0.254: 8255A.6 19.68,43.81 18.41,43.81 17.14,42.55 17.14,33.02 21.59,33.02 34.29,20.32 55.88,20.32 65.41,10.79 116.2,10.79 116.84,11.43 IC10.9
LED
  Top 0.254: 8255A.4 29.84,49.53 29.84,80.01 30.48,80.64 R9.P$2
MCP_CLK
  Top 0.254: MONITOR.28 73.66,77.47 72.39,78.74 72.39,82.55 69.85,85.09 69.85,92.08 66.04,95.89 GPIO_EXP.12
MCP_CS
  Top 0.254: MONITOR.27 71.12,76.2 69.85,77.47 69.85,83.82 63.5,90.17 GPIO_EXP.11
MCP_SI
  Top 0.254: MONITOR.29 76.2,76.2 74.93,77.47 74.93,81.28 72.39,83.82 72.39,92.08 68.58,95.89 GPIO_EXP.13
MCP_SO
  Top 0.254: MONITOR.30 78.74,76.2 77.47,77.47 77.47,81.28 78.11,81.92 78.11,88.9 71.12,95.89 GPIO_EXP.14
N$1
  Top 0.254: T1.2 22.23,88.9 22.23,82.55 22.86,81.92 R9.P$1 R8.P$2
N$2
  Bottom 0.61: LM2940.1 C15.1 179.07,107.95 179.07,101.6 181.61,99.06 S1.1
N$3
  Top 0.254: Q1.1 100.33,45.72 P8085AH.2
  Bottom 0.254: Q1.1 C2.1
N$4
  Top 0.254: Q1.2 102.87,45.72 P8085AH.1
N$5
  Bottom 0.61: S1.2 189.23,96.52 190.5,97.79 190.5,104.41 J3.PWR
N$6
  Top 0.254: R1.P$1 114.3,110.49 DISPLAY.11
N$7
  Top 0.254: R2.P$1 116.84,109.22 DISPLAY.10
N$8
  Top 0.254: R3.P$1 119.38,107.95 DISPLAY.9
N$9
  Top 0.254: R4.P$1 121.92,106.68 DISPLAY.8
N$10
  Top 0.254: DISPLAY.7 R5.P$1
N$11  (via drill 0.6)
  other vias: 24.13,64.77
N$12
  Top 0.254: R11.P$2 PWR_LED.K
N$13
  Top 0.254: T1.3 18.41,95.89 18.41,105.41 17.78,106.05 R10.P$1
N$14
  Top 0.254: R10.P$2 LED1.K
PRST  (via drill 0.51)
  Top 0.254: P8085AH.3 97.79,44.45 93.98,48.26 92.08,48.26 90.81,49.53 88.9,49.53 v88.9,48.9
  Bottom 0.254: 8255A.35 38.73,47.62 40.64,47.62 41.27,48.26 R13.P$2 42.55,48.26 43.18,47.62 70.48,47.62 72.39,49.53 88.27,49.53 v88.9,48.9
R0
  Top 0.254: GPIO_EXP.21 59.69,109.22 KEYPAD.1
R1
  Top 0.254: GPIO_EXP.22 53.34,107.95 57.15,111.76 KEYPAD.2
R2
  Top 0.254: GPIO_EXP.23 50.8,107.95 54.61,111.76 KEYPAD.3
R3
  Top 0.254: GPIO_EXP.24 48.26,107.95 52.07,111.76 KEYPAD.4
R4
  Top 0.254: GPIO_EXP.25 45.72,107.95 49.53,111.76 KEYPAD.5
RST75
  Top 0.254: P8085AH.7 87.63,44.45 85.72,46.35 85.09,46.35 R12.P$2 85.09,47.62 84.45,48.26 84.45,53.98 76.83,53.98 73.03,57.78 73.03,60.33 MONITOR.26
RSTIN
  Top 0.254: P8085AH.36 92.71,23.5 91.44,22.23 IN4148.A 91.44,16.51 R6.P$1 | MONITOR.24 63.5,40.64 73.66,30.48 76.2,30.48 76.2,25.4 82.55,19.05 C1.1
  Bottom 0.254: IN4148.A 90.17,19.05 C1.1
S0
  Top 0.254: P8085AH.29 69.85,31.75 60.33,31.75 60.33,36.2 55.88,40.64 55.88,43.18 56.52,43.81 56.52,62.87 55.88,63.5 MONITOR.21
S1  (via drill 0.51)
  Top 0.254: v53.34,33.02 50.16,36.2 50.16,72.39 55.88,78.11 MONITOR.20
  Bottom 0.254: P8085AH.33 85.09,31.75 54.61,31.75 v53.34,33.02
SW
  Top 0.254: U$3.1 10.79,67.31 10.79,21.59 18.41,13.97 8255A.18
SW0
  Top 0.254: U$3.3 11.43,65.41 11.43,56.52 13.97,53.98 R7.P$2
  Bottom 0.254: C17.1 39.37,67.31 U$3.3
TFT_CLK  (via drill 0.51)
  Top 0.254: v109.22,65.41 120.02,76.2 120.02,96.52 120.65,97.16 R4.P$2
  Bottom 0.254: MONITOR.40 104.78,65.41 v109.22,65.41
TFT_CS  (via drill 0.51)
  Top 0.254: v113.03,67.31 123.83,78.11 123.83,96.52 124.46,97.16 R5.P$2
  Bottom 0.254: MONITOR.37 99.06,62.23 107.95,62.23 v113.03,67.31
TFT_RS
  Top 0.254: MONITOR.38 99.06,77.47 100.33,78.74 100.33,92.08 108.58,100.33 112.39,100.33 112.39,99.06 113.03,98.42 R2.P$2
TFT_RST  (via drill 0.51)
  Top 0.254: MONITOR.36 93.98,73.03 v95.25,74.3 | v108.58,80.01 108.58,96.52 109.22,97.16 R1.P$2
  Bottom 0.254: v95.25,74.3 96.52,75.56 104.14,75.56 v108.58,80.01
TFT_SDA  (via drill 0.51)
  Top 0.254: v109.22,67.31 116.2,74.3 116.2,96.52 116.84,97.16 R3.P$2
  Bottom 0.254: MONITOR.39 104.14,67.31 v109.22,67.31
VDD  (via drill 0.51)
  Top 0.61: U$3.4 8.89,76.83 8.89,94.61 7.62,95.89 LED1.A | C13.1 GPIO_EXP.9 58.42,99.06 62.87,103.5 62.87,104.78 GPIO_EXP.18 | C11.1 89.53,90.81 90.17,90.81 DEBUG_PORT.4 | MONITOR.32 83.82,73.66 82.55,74.93 | 82.55,74.93 78.74,78.74 MONITOR.11 | 82.55,74.93 v83.19,75.56 | R6.P$2 IN4148.C | 160.66,68.58 162.56,68.58 C5.1 | 160.66,68.58 LATCH.20 | 167.64,66.04 160.66,66.04 160.66,68.58 | 167.64,66.04 169.54,66.04 | 169.54,66.04 PWR_LED.A | VREG3V3.OUT 169.54,95.89 169.54,66.04 | C10.1 167.64,66.04 | MONITOR.1 107.31,80.01 107.31,73.66 107.95,73.03 107.95,33.66 109.22,32.38 C7.1
  Bottom 0.61: LM2940.3 166.37,114.3 C21.1 C16.1 166.37,101.6 170.18,97.79 VREG3V3.OUT | MONITOR.1 104.14,76.83 84.45,76.83 v83.19,75.56 | C11.1 83.82,83.19 83.19,83.19 82.55,82.55 80.01,82.55 78.74,81.28 MONITOR.11 | GPIO_EXP.18 63.5,100.97 80.64,100.97 89.53,92.08 89.53,91.44 DEBUG_PORT.4 | U$3.4 19.68,78.74 43.81,78.74 57.78,92.71 C13.1 | 8255A.26 36.2,22.23 37.47,22.23 39.37,24.13 | 39.37,24.13 40.64,25.4 C12.1 | 90.17,23.5 90.17,22.86 97.79,22.86 | 90.17,23.5 P8085AH.35 | 97.79,22.86 100.33,20.32 IN4148.C | 97.79,22.86 102.87,22.86 P8085AH.40 103.5,26.67 107.95,31.11 108.58,31.11 C7.1 | 39.37,24.13 40.64,22.86 84.45,22.86 85.72,24.13 87,24.13 87.63,23.5 90.17,23.5 | 137.79,13.34 IC10.16 | 137.79,13.34 140.97,13.34 141.6,12.7 C14.1 144.78,12.7 163.83,31.75 163.83,34.92 | HM6116.24 163.19,34.92 163.83,34.92 | 163.83,34.92 166.37,34.92 167,34.29 C10.1 | R6.P$2 116.84,13.97 117.47,14.61 136.53,14.61 137.79,13.34

### Text on the board
tPlace: RHO85 / Microprocessor trainer / [Brian Ejike]